# EAGLE design TDA7429_BREAKOUT (EAGLE 7.3.0)
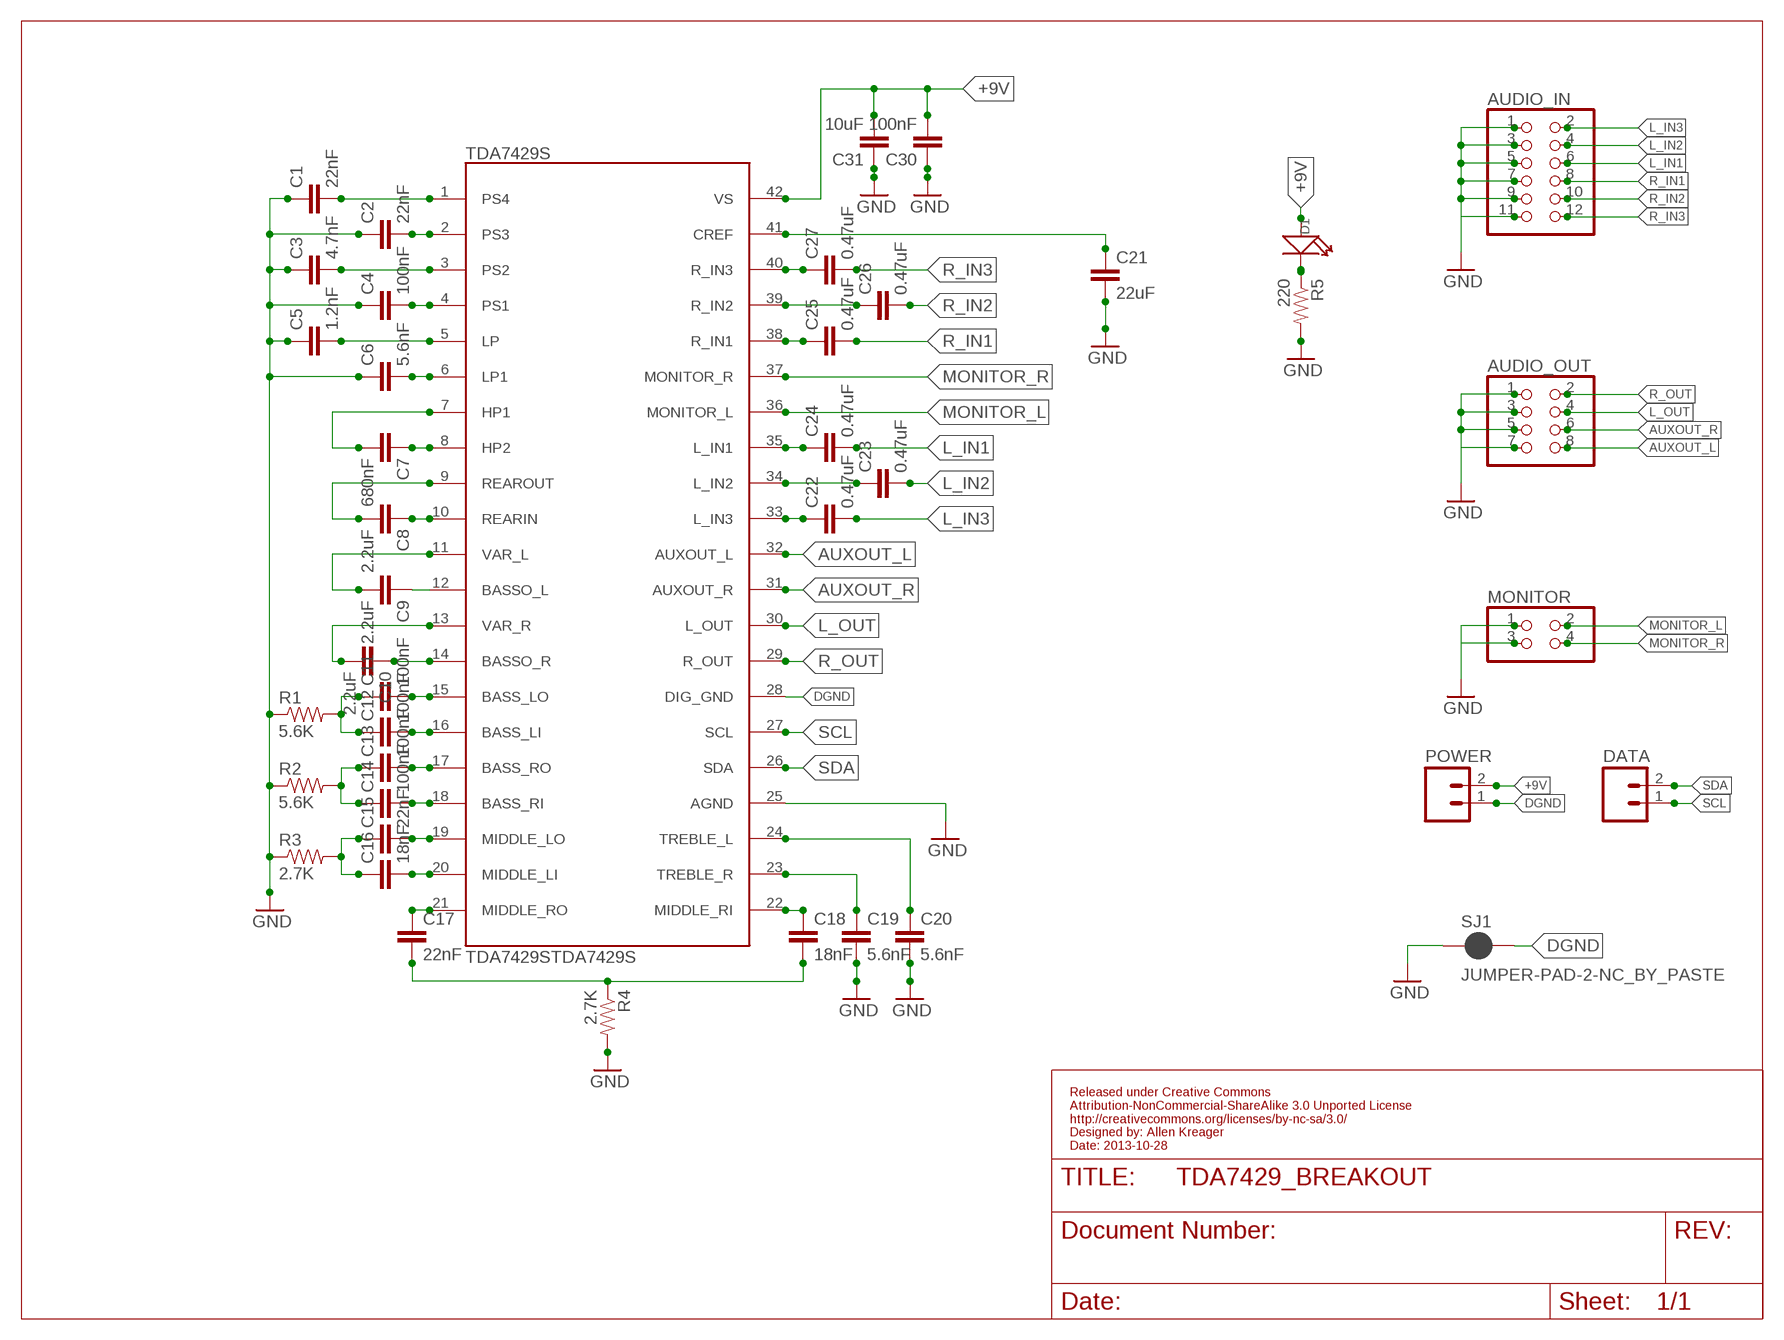
[diagram p0: schematic, sheet 1]

## Parts
AUDIO_IN  PINHD-2X6  [2X06]
AUDIO_OUT  PINHD-2X4  [2X04]
C1  22nF  CAP0805  [0805]
C2  22nF  CAP0805  [0805]
C3  4.7nF  CAP0805  [0805]
C4  100nF  CAP0805  [0805]
C5  1.2nF  CAP0805  [0805]
C6  5.6nF  CAP0805  [0805]
C7  680nF  CAP0805  [0805]
C8  2.2uF  CAP0805  [0805]
C9  2.2uF  CAP0805  [0805]
C10  2.2uF  CAP0805  [0805]
C11  100nF  CAP0805  [0805]
C12  100nF  CAP0805  [0805]
C13  100nF  CAP0805  [0805]
C14  100nF  CAP0805  [0805]
C15  22nF  CAP0805  [0805]
C16  18nF  CAP0805  [0805]
C17  22nF  CAP0805  [0805]
C18  18nF  CAP0805  [0805]
C19  5.6nF  CAP0805  [0805]
C20  5.6nF  CAP0805  [0805]
C21  22uF  CAP0805  [0805]
C22  0.47uF  CAP0805  [0805]
C23  0.47uF  CAP0805  [0805]
C24  0.47uF  CAP0805  [0805]
C25  0.47uF  CAP0805  [0805]
C26  0.47uF  CAP0805  [0805]
C27  0.47uF  CAP0805  [0805]
C30  100nF  CAP0805  [0805]
C31  10uF  CAP0805  [0805]
D1  LED  [LED0603]
DATA  M02PTH  [1X02]
MONITOR  PINHD-2X2  [2X02]
POWER  M02PTH  [1X02]
R1  5.6K  RESISTOR0805-RES  [0805]
R2  5.6K  RESISTOR0805-RES  [0805]
R3  2.7K  RESISTOR0805-RES  [0805]
R4  2.7K  RESISTOR0805-RES  [0805]
R5  220  RESISTOR0805-RES  [0805]
SJ1  JUMPER-PAD-2-NC_BY_PASTE  [PAD-JUMPER-2-NC_BY_PASTE_YES_SILK]
TDA7429S  TDA7429STDA7429S  [SDIP42]

## Nets
+9V: C30.2 C31.2 D1.+ POWER.2 TDA7429S.42(VS)
AUXOUT_L: AUDIO_OUT.8 TDA7429S.32(AUXOUT_L)
AUXOUT_R: AUDIO_OUT.6 TDA7429S.31(AUXOUT_R)
DGND: POWER.1 SJ1.2 TDA7429S.28(DIG_GND)
GND: AUDIO_IN.1 AUDIO_IN.3 AUDIO_IN.5 AUDIO_IN.7 AUDIO_IN.9 AUDIO_IN.11 AUDIO_OUT.1 AUDIO_OUT.3 AUDIO_OUT.5 AUDIO_OUT.7 C1.1 C2.1 C3.1 C4.1 C5.1 C6.1 C19.2 C20.2 C21.2 C30.1 C31.1 MONITOR.1 MONITOR.3 R1.1 R2.1 R3.1 R4.2 R5.2 SJ1.1 TDA7429S.25(AGND)
HP1: C7.2 TDA7429S.7(HP1)
L_IN1: AUDIO_IN.6 C24.2
L_IN2: AUDIO_IN.4 C23.2
L_IN3: AUDIO_IN.2 C22.2
L_OUT: AUDIO_OUT.4 TDA7429S.30(L_OUT)
MONITOR_L: MONITOR.2 TDA7429S.36(MONITOR_L)
MONITOR_R: MONITOR.4 TDA7429S.37(MONITOR_R)
N$1: D1.- R5.1
N$2: C9.1 TDA7429S.12(BASSO_L)
N$4: C3.2 TDA7429S.3(PS2)
N$5: C1.2 TDA7429S.1(PS4)
N$6: C2.2 TDA7429S.2(PS3)
N$7: C4.2 TDA7429S.4(PS1)
N$8: C5.2 TDA7429S.5(LP)
N$9: C6.2 TDA7429S.6(LP1)
N$11: C7.1 TDA7429S.8(HP2)
N$13: C8.1 TDA7429S.10(REARIN)
N$15: C10.1 TDA7429S.14(BASSO_R)
N$16: C11.2 TDA7429S.15(BASS_LO)
N$17: C11.1 C12.1 R1.2
N$18: C12.2 TDA7429S.16(BASS_LI)
N$19: C13.2 TDA7429S.17(BASS_RO)
N$20: C13.1 C14.1 R2.2
N$21: C14.2 TDA7429S.18(BASS_RI)
N$22: C15.2 TDA7429S.19(MIDDLE_LO)
N$23: C16.2 TDA7429S.20(MIDDLE_LI)
N$24: C15.1 C16.1 R3.2
N$25: C17.1 TDA7429S.21(MIDDLE_RO)
N$26: C18.1 TDA7429S.22(MIDDLE_RI)
N$27: C17.2 C18.2 R4.1
N$28: C19.1 TDA7429S.23(TREBLE_R)
N$29: C20.1 TDA7429S.24(TREBLE_L)
N$35: C27.1 TDA7429S.40(R_IN3)
N$36: C26.1 TDA7429S.39(R_IN2)
N$37: C25.1 TDA7429S.38(R_IN1)
N$38: C24.1 TDA7429S.35(L_IN1)
N$39: C23.1 TDA7429S.34(L_IN2)
N$40: C22.1 TDA7429S.33(L_IN3)
N$44: C21.1 TDA7429S.41(CREF)
R_IN1: AUDIO_IN.8 C25.2
R_IN2: AUDIO_IN.10 C26.2
R_IN3: AUDIO_IN.12 C27.2
R_OUT: AUDIO_OUT.2 TDA7429S.29(R_OUT)
REAROUT: C8.2 TDA7429S.9(REAROUT)
SCL: DATA.1 TDA7429S.27(SCL)
SDA: DATA.2 TDA7429S.26(SDA)
VAR_L: C9.2 TDA7429S.11(VAR_L)
VAR_R: C10.2 TDA7429S.13(VAR_R)

## Notes on the sheet
- Released under Creative Commons
  Attribution-NonCommercial-ShareAlike 3.0 Unported License
  http://creativecommons.org/licenses/by-nc-sa/3.0/
  Designed by: Allen Kreager
  Date: 2013-10-28

## Library data of the parts
AUDIO_IN = pinhead:PINHD-2X6: PIN HEADER
AUDIO_OUT = pinhead:PINHD-2X4: PIN HEADER
C1-C27 C30 C31 = SparkFun-Passives:CAP: Capacitor Standard 0603 ceramic capacitor, and 0.1" leaded capacitor.
D1 = OPL Eagle Library:LED*: LED
DATA POWER = SparkFun-Connectors:M02: Standard 2-pin 0.1" header. Use with - straight break away headers ( PRT-00116) - right angle break away headers (PRT-00553) - swiss pins (PRT-00743) - machine pins (PRT-00117) - female headers (PRT-00115) Molex polarized connector foot print use with: PRT-08233 with associated crimp pins and housings. 2.54_SCREWTERM for use with PRT-10571. 3.5mm Screw Terminal footprints for PRT-08084 5mm Screw Terminal footprints for use with PRT-08433
MONITOR = pinhead:PINHD-2X2: PIN HEADER
R1-R5 = SparkFun-Passives:RESISTOR: Resistor Basic schematic elements and footprints for 0603, 1206, and PTH resistors.
SJ1 = SparkFun-Passives:JUMPER-PAD-2-NC_BY_PASTE
TDA7429S = ATK_lib:TDA7429S

## Board
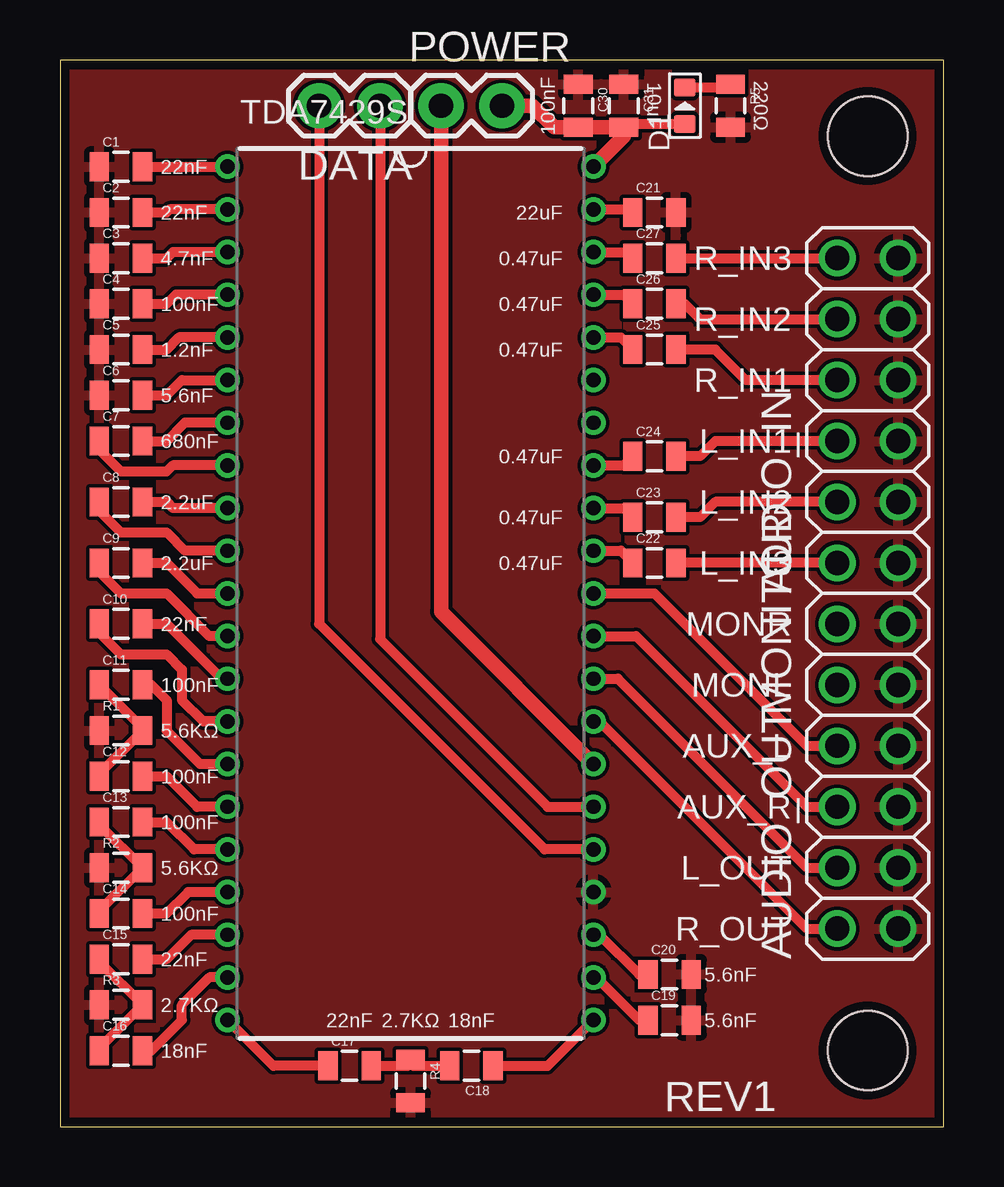
[diagram p1: board, top side]
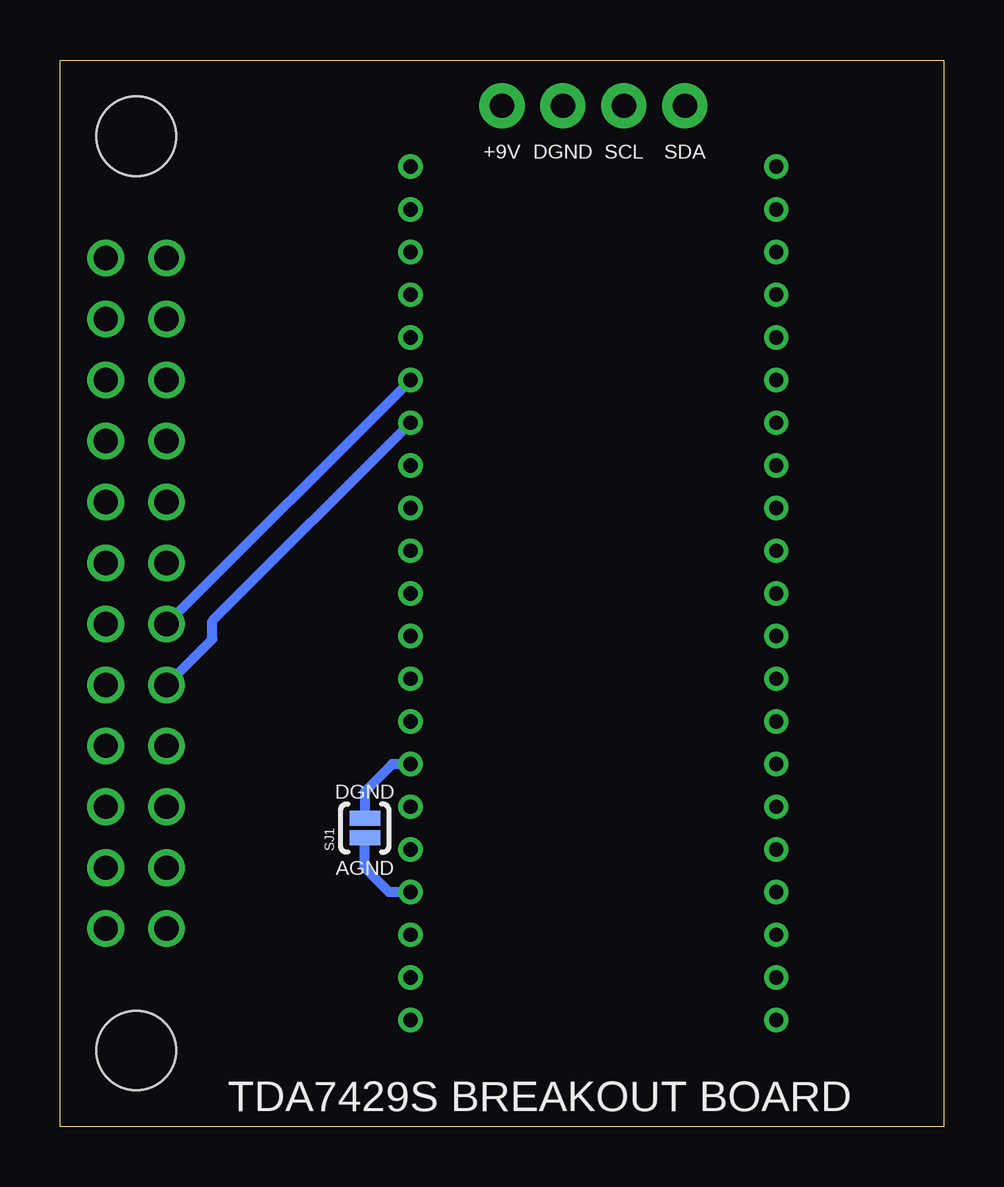
[diagram p2: board, bottom side, seen from below]

Size 36.83 x 44.45 mm. Coordinates in mm from the lower left corner, seen from the top.
Outline: 0,0 36.83,0 36.83,44.45 0,44.45 0,0
Copper layers (1*16): Top 0.0356mm / dielectric 1.5011mm / Bottom 0.0356mm
Design rules "LaenPCBOrder": minimum track width 6mil, minimum drill 13mil, track to track 6mil, track to pad 6mil, pad to pad 6mil, via to via 6mil, smd to smd 6mil, copper to edge 15mil, drill to drill 6mil, minimum pad ring 7mil, minimum via ring 7mil, stop-mask expansion 3mil, vias tented up to drill 0mil, thermal gap 10mil

### Footprints (pad centres in the part's own frame; a part is rotated, then mirrored left to right if it is on the bottom)
2X06 = drill 1.016: 1 -6.35,-1.27; 2 -6.35,1.27; 3 -3.81,-1.27; 4 -3.81,1.27; 5 -1.27,-1.27; 6 -1.27,1.27; 7 1.27,-1.27; 8 1.27,1.27; 9 3.81,-1.27; 10 3.81,1.27; 11 6.35,-1.27; 12 6.35,1.27
2X04 = drill 1.016: 1 -3.81,-1.27; 2 -3.81,1.27; 3 -1.27,-1.27; 4 -1.27,1.27; 5 1.27,-1.27; 6 1.27,1.27; 7 3.81,-1.27; 8 3.81,1.27
0805 = smd 0.8 x 1.2: 1 -0.9,0; 2 0.9,0
LED0603 = smd 0.762 x 0.889: + -0.762,0; - 0.762,0
1X02 = drill 1.016 pad 1.88: 1 0,0; 2 2.54,0
2X02 = drill 1.016: 1 -1.27,-1.27; 2 -1.27,1.27; 3 1.27,-1.27; 4 1.27,1.27
PAD-JUMPER-2-NC_BY_PASTE_YES_SILK = smd 0.635 x 1.27: 1 -0.401,0; 2 0.413,0
SDIP42 = drill 0.6 pad 1.016: 1 -7.62,17.78; 2 -7.62,16.002; 3 -7.62,14.224; 4 -7.62,12.446; 5 -7.62,10.668; 6 -7.62,8.89; 7 -7.62,7.112; 8 -7.62,5.334; 9 -7.62,3.556; 10 -7.62,1.778; 11 -7.62,0; 12 -7.62,-1.778; 13 -7.62,-3.556; 14 -7.62,-5.334; 15 -7.62,-7.112; 16 -7.62,-8.89; 17 -7.62,-10.668; 18 -7.62,-12.446; 19 -7.62,-14.224; 20 -7.62,-16.002; 21 -7.62,-17.78; 22 7.62,-17.78; 23 7.62,-16.002; 24 7.62,-14.224; 25 7.62,-12.446; 26 7.62,-10.668; 27 7.62,-8.89; 28 7.62,-7.112; 29 7.62,-5.334; 30 7.62,-3.556; 31 7.62,-1.778; 32 7.62,0; 33 7.62,1.778; 34 7.62,3.556; 35 7.62,5.334; 36 7.62,7.112; 37 7.62,8.89; 38 7.62,10.668; 39 7.62,12.446; 40 7.62,14.224; 41 7.62,16.002; 42 7.62,17.78
STAND-OFF = hole 3.302: 0,0

### Placement (x,y rotation side)
AUDIO_IN  33.66,29.84 90 top
AUDIO_OUT  33.66,12.06 90 top
C1  2.54,40.01 0 top
C2  2.54,38.1 0 top
C3  2.54,36.2 0 top
C4  2.54,34.29 0 top
C5  2.54,32.38 0 top
C6  2.54,30.48 0 top
C7  2.54,28.57 0 top
C8  2.54,26.04 0 top
C9  2.54,23.5 0 top
C10  2.54,20.95 0 top
C11  2.54,18.41 0 top
C12  2.54,14.61 0 top
C13  2.54,12.7 0 top
C14  2.54,8.89 0 top
C15  2.54,6.99 0 top
C16  2.54,3.17 0 top
C17  12.06,2.54 0 top
C18  17.14,2.54 180 top
C19  25.4,4.45 0 top
C20  25.4,6.35 0 top
C21  24.77,38.1 0 top
C22  24.77,23.5 0 top
C23  24.77,25.4 0 top
C24  24.77,27.94 0 top
C25  24.77,32.38 0 top
C26  24.77,34.29 0 top
C27  24.77,36.2 0 top
C30  21.59,42.55 270 top
C31  23.5,42.55 270 top
D1  26.04,42.55 90 top
DATA  13.34,42.55 180 top
MONITOR  33.66,19.68 90 top
POWER  15.88,42.55 0 top
R1  2.54,16.51 0 top
R2  2.54,10.79 0 top
R3  2.54,5.08 0 top
R4  14.61,1.91 270 top
R5  27.94,42.55 270 top
SJ1  24.13,12.45 90 bottom
TDA7429S  14.61,22.23 0 top
U$1  [STAND-OFF]  33.66,41.27 0 top
U$2  [STAND-OFF]  33.66,3.17 0 top

### Tracks (layer width: path | path; a pad name or v marks a point on that pad's centre or on a via)
+9V
  Top 0.406: D1.+ 23.63,41.78 C31.2
  Top 0.61: TDA7429S.42 23.5,41.27 C31.2 C30.2 20.59,41.65 19.68,42.55 POWER.2
AUXOUT_L
  Top 0.406: TDA7429S.32 24.77,22.23 31.11,15.88 AUDIO_OUT.8
AUXOUT_R
  Top 0.406: TDA7429S.31 24,20.45 31.11,13.34 AUDIO_OUT.6
DGND
  Top 0.61: TDA7429S.28 15.88,21.46 POWER.1
  Bottom 0.406: TDA7429S.28 22.99,15.11 24.13,13.97 SJ1.2
GND
  Bottom 0.406: TDA7429S.25 23.11,9.78 24.13,10.79 SJ1.1
  pour Top: -0.64,45.09 37.47,45.09 37.47,-0.64 -0.64,-0.64
HP1
  Top 0.406: C7.2 4.45,28.57 5.21,29.34 TDA7429S.7
L_IN1
  Top 0.406: AUDIO_IN.6 27.3,28.57 26.67,27.94 C24.2
L_IN2
  Top 0.406: AUDIO_IN.4 27.3,26.04 26.67,25.4 C23.2
L_IN3
  Top 0.406: AUDIO_IN.2 C22.2
L_OUT
  Top 0.406: TDA7429S.30 23.24,18.67 31.11,10.79 AUDIO_OUT.4
MONITOR_L
  Bottom 0.406: TDA7429S.36 30.48,21.08 30.48,20.32 MONITOR.2
MONITOR_R
  Bottom 0.406: TDA7429S.37 MONITOR.4
N$1
  Top 0.406: D1.- 27.8,43.31 R5.1
N$2
  Top 0.406: C9.1 1.65,23.11 2.54,22.23 4.45,22.23 6.22,20.45 TDA7429S.12
N$4
  Top 0.406: C3.2 4.45,36.2 4.7,36.45 TDA7429S.3
N$5
  Top 0.406: C1.2 TDA7429S.1
N$6
  Top 0.406: C2.2 4.45,38.1 4.57,38.23 TDA7429S.2
N$7
  Top 0.406: C4.2 4.45,34.29 4.83,34.67 TDA7429S.4
N$8
  Top 0.406: C5.2 4.45,32.38 4.95,32.89 TDA7429S.5
N$9
  Top 0.406: C6.2 4.45,30.48 5.08,31.11 TDA7429S.6
N$11
  Top 0.406: C7.1 1.65,28.19 2.54,27.3 4.45,27.3 4.7,27.56 TDA7429S.8
N$13
  Top 0.406: C8.1 1.65,25.65 2.54,24.77 4.45,24.77 5.21,24 TDA7429S.10
N$15
  Top 0.406: C10.1 1.65,20.57 2.54,19.68 4.45,19.68 5.08,19.05 5.08,17.78 5.97,16.89 TDA7429S.14
N$16
  Top 0.406: TDA7429S.15 5.84,15.11 4.45,16.51 4.45,17.78 3.81,18.41 C11.2
N$17
  Top 0.406: C11.1 3.44,16.61 R1.2 1.64,14.71 C12.1
N$18
  Top 0.406: TDA7429S.16 5.71,13.34 4.45,14.61 C12.2
N$19
  Top 0.406: TDA7429S.17 5.59,11.56 4.45,12.7 C13.2
N$20
  Top 0.406: C13.1 1.64,12.6 R2.2 1.64,8.99 C14.1
N$21
  Top 0.406: TDA7429S.18 5.33,9.78 4.45,8.89 C14.2
N$22
  Top 0.406: TDA7429S.19 5.46,8 4.45,6.99 C15.2
N$23
  Top 0.406: TDA7429S.20 6.22,6.22 5.08,5.08 5.08,4.45 3.81,3.17 C16.2
N$24
  Top 0.406: C15.1 1.64,6.88 R3.2 1.64,3.28 C16.1
N$25
  Top 0.406: C17.1 8.89,2.54 TDA7429S.21
N$26
  Top 0.406: C18.1 20.32,2.54 TDA7429S.22
N$27
  Top 0.406: C17.2 14.48,2.54 R4.1 14.73,2.54 C18.2
N$28
  Top 0.406: TDA7429S.23 22.35,6.22 24.13,4.45 C19.1
N$29
  Top 0.406: TDA7429S.24 22.48,8 24.13,6.35 C20.1
N$35
  Top 0.406: TDA7429S.40 23.62,36.45 C27.1
N$36
  Top 0.406: TDA7429S.39 23.5,34.67 C26.1
N$37
  Top 0.406: TDA7429S.38 23.37,32.89 C25.1
N$38
  Top 0.406: TDA7429S.35 23.5,27.56 C24.1
N$39
  Top 0.406: TDA7429S.34 23.5,25.78 C23.1
N$40
  Top 0.406: TDA7429S.33 23.37,24 C22.1
N$44
  Top 0.406: TDA7429S.41 23.75,38.23 C21.1
R_IN1
  Top 0.406: AUDIO_IN.8 28.57,31.11 27.3,32.38 C25.2
R_IN2
  Top 0.406: C26.2 26.04,34.29 26.67,33.66 AUDIO_IN.10
R_IN3
  Top 0.406: C27.2 AUDIO_IN.12
R_OUT
  Top 0.406: TDA7429S.29 22.48,16.89 31.11,8.26 AUDIO_OUT.2
REAROUT
  Top 0.406: C8.2 4.45,26.04 4.7,25.78 TDA7429S.9
SCL
  Top 0.406: DATA.1 13.34,20.32 20.32,13.34 TDA7429S.27
SDA
  Top 0.406: DATA.2 10.79,20.95 20.19,11.56 TDA7429S.26
VAR_L
  Top 0.406: C9.2 4.45,23.5 5.71,22.23 TDA7429S.11
VAR_R
  Top 0.406: C10.2 4.45,20.95 6.73,18.67 TDA7429S.13

### Text on the board
tPlace: 100nF | 10uF | 220Ω | 22nF | 22nF | 22uF | 4.7nF | 0.47uF | R_IN3 | 100nF | 0.47uF | R_IN2 | 1.2nF | 0.47uF | R_IN1 | 5.6nF | 680nF | L_IN1 | 0.47uF | 2.2uF | L_IN2 | 0.47uF | 2.2uF | 0.47uF | L_IN3 | 22nF | MONR | 100nF | MONL | 5.6KΩ | AUX_L | 100nF | 100nF | AUX_R | 5.6KΩ | L_OUT | 100nF | R_OUT | 22nF | 5.6nF | 2.7KΩ | 22nF | 2.7KΩ | 18nF | 5.6nF | 18nF | REV1
bPlace: SDA | SCL | DGND | +9V | DGND | AGND | TDA7429S BREAKOUT BOARD
tDocu: Released under Creative Commons / Attribution-NonCommercial-ShareAlike 3.0 Unported License / http://creativecommons.org/licenses/by-nc-sa/3.0/ / Designed by: Allen Kreager / Date: 2013-10-28
Top_Names: R5 | D1 | C31 | C30 | C1 | C2 | C21 | C3 | C27 | C4 | C26 | C5 | C25 | C6 | C7 | C24 | C8 | C23 | C9 | C22 | C10 | C11 | R1 | C12 | C13 | R2 | C14 | C20 | C15 | C19 | R3 | C16 | C17 | C18 | R4
216bmp: Allen Kreager